# EAGLE schematic LB_SMD (EAGLE 5.11)
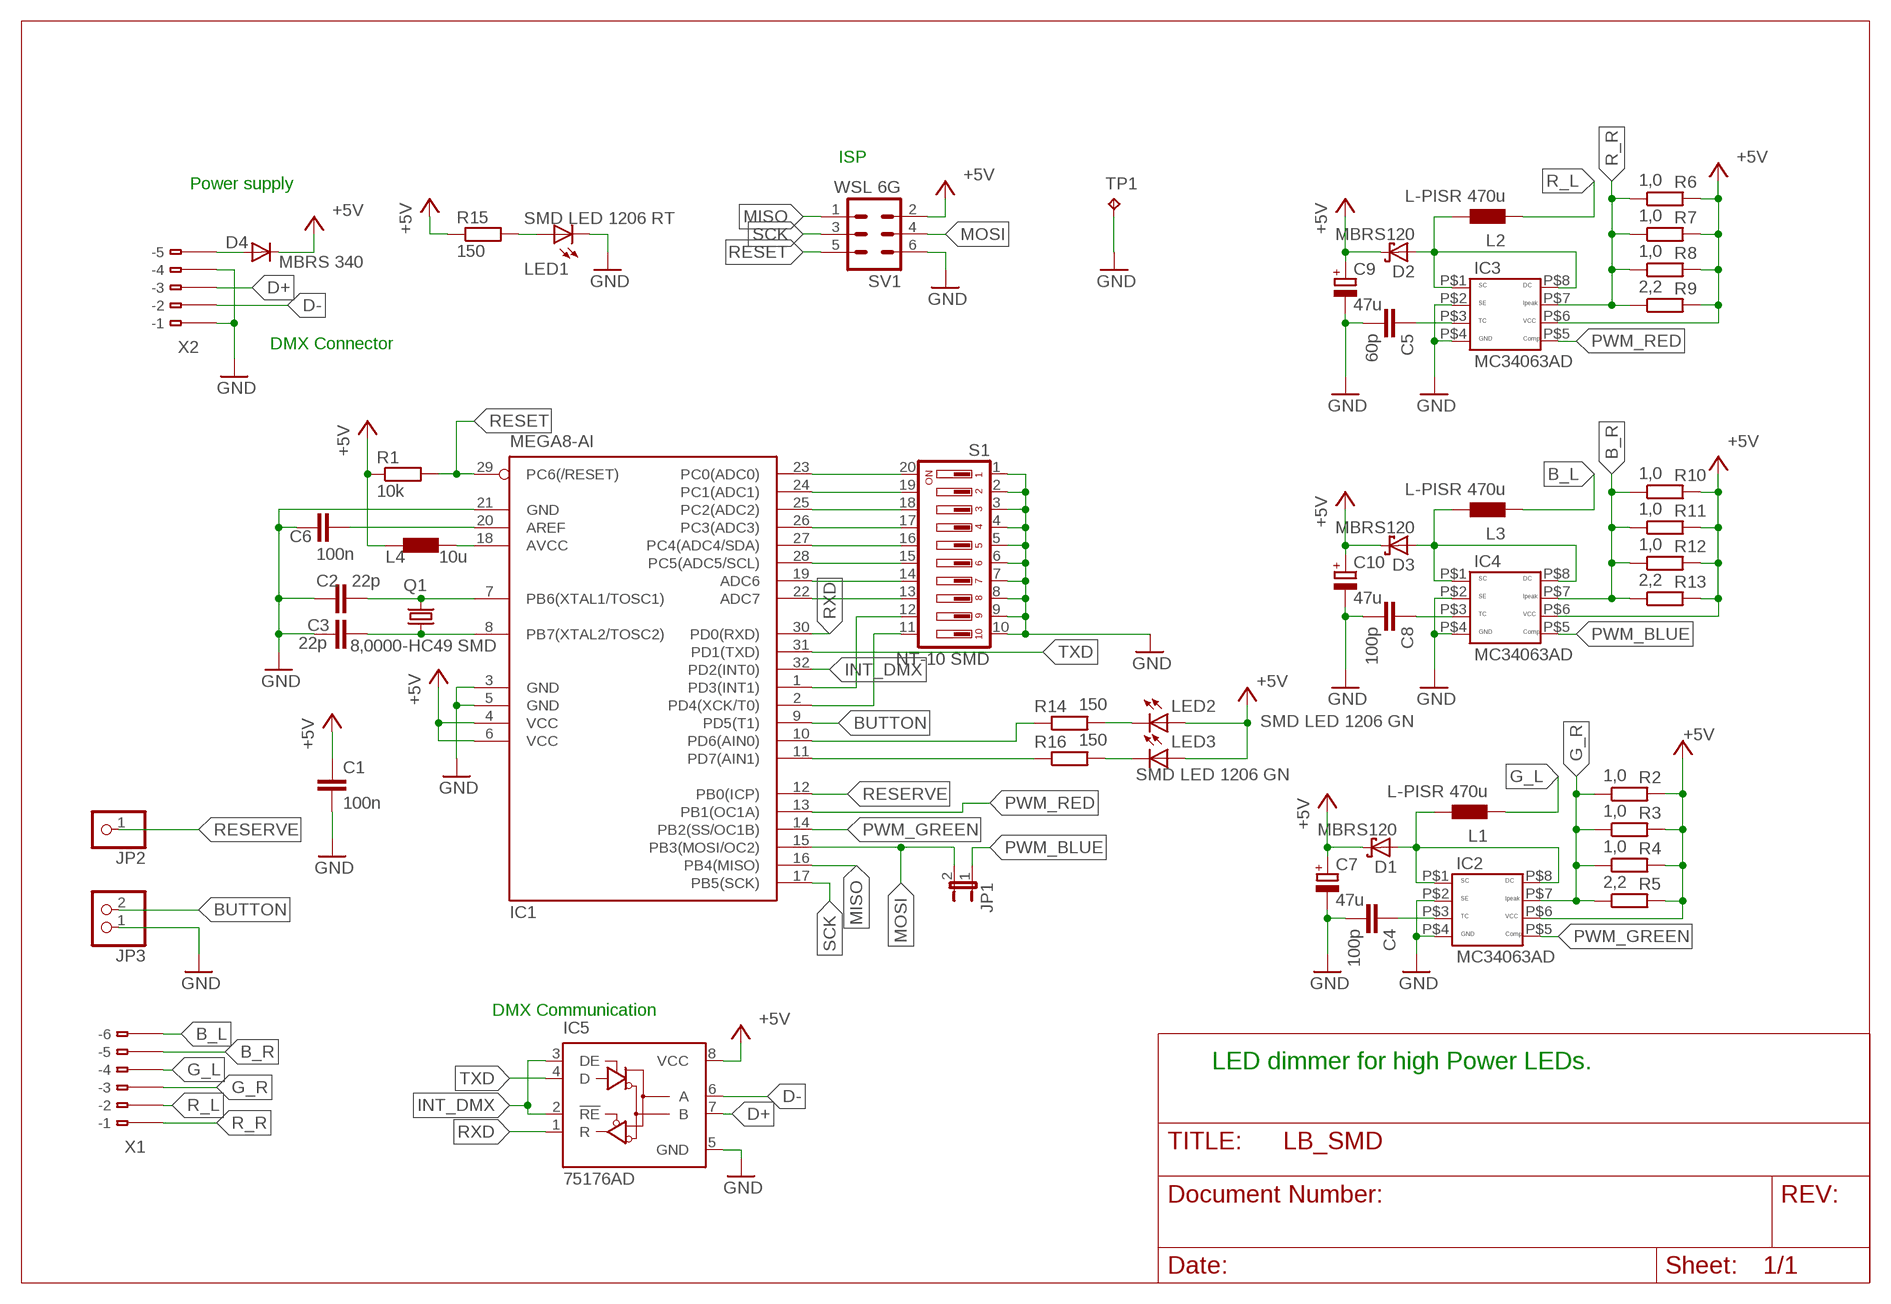
[diagram p0: schematic, sheet 1]

## Parts
C1  100n  C-EUC1206  [C1206]
C2  22p  C-EUC1206  [C1206]
C3  22p  C-EUC1206  [C1206]
C4  100p  C-EUC1206  [C1206]
C5  60p  C-EUC1206  [C1206]
C6  100n  C-EUC1206  [C1206]
C7  47u  CPOL-EUUD-5X5,8  [UD-5X5,8_NICHICON]
C8  100p  C-EUC1206  [C1206]
C9  47u  CPOL-EUUD-5X5,8  [UD-5X5,8_NICHICON]
C10  47u  CPOL-EUUD-5X5,8  [UD-5X5,8_NICHICON]
D1  MBRS120  SCHOTTKY-DIODESMD  [SMB]
D2  MBRS120  SCHOTTKY-DIODESMD  [SMB]
D3  MBRS120  SCHOTTKY-DIODESMD  [SMB]
D4  MBRS 340  DIODE-DO214AA  [DO214AA]
IC1  MEGA8-AI  [TQFP32-08]
IC2  MC34063AD  DIL8  [DIL08]
IC3  MC34063AD  DIL8  [DIL08]
IC4  MC34063AD  DIL8  [DIL08]
IC5  75176AD  [D_R-PDSO-G8]
JP1  JP1E  [JP1]
JP2  PINHD-1X1  [1X01]
JP3  PINHD-1X2  [1X02]
L1  L-PISR 470u  PIS2408  [PIS2408]
L2  L-PISR 470u  PIS2408  [PIS2408]
L3  L-PISR 470u  PIS2408  [PIS2408]
L4  10u  1206F  [1206F]
LED1  SMD LED 1206 RT  LEDCHIPLED_1206  [CHIPLED_1206]
LED2  SMD LED 1206 GN  LEDCHIPLED_1206  [CHIPLED_1206]
LED3  SMD LED 1206 GN  LEDCHIPLED_1206  [CHIPLED_1206]
Q1  8,0000-HC49 SMD  CRYSTALSM49  [SM49]
R1  10k  R-EU_M1206  [M1206]
R2  1,0  R-EU_M1206  [M1206]
R3  1,0  R-EU_M1206  [M1206]
R4  1,0  R-EU_M1206  [M1206]
R5  2,2  R-EU_M1206  [M1206]
R6  1,0  R-EU_M1206  [M1206]
R7  1,0  R-EU_M1206  [M1206]
R8  1,0  R-EU_M1206  [M1206]
R9  2,2  R-EU_M1206  [M1206]
R10  1,0  R-EU_M1206  [M1206]
R11  1,0  R-EU_M1206  [M1206]
R12  1,0  R-EU_M1206  [M1206]
R13  2,2  R-EU_M1206  [M1206]
R14  150  R-EU_M1206  [M1206]
R15  150  R-EU_M1206  [M1206]
R16  150  R-EU_M1206  [M1206]
S1  NT-10 SMD  219-10  [CTS-219-10]
SV1  WSL 6G  MA03-2  [MA03-2]
TP1  TPTP18R  [TP18R]
X1  233-506  [233-506]
X2  233-505  [233-505]

## Nets
+5V: C1.1 C7.+ C9.+ C10.+ D1.C D2.C D3.C D4.C IC1.4(VCC) IC1.6(VCC) IC2.P$6 IC3.P$6 IC4.P$6 IC5.8(VCC) L4.P$1 LED2.A LED3.A R1.1 R2.2 R3.2 R4.2 R5.2 R6.2 R7.2 R8.2 R9.2 R10.2 R11.2 R12.2 R13.2 R15.1 SV1.2
B_L: L3.P$1 X1.B6(B-6)
B_R: IC4.P$7 R10.1 R11.1 R12.1 R13.1 X1.B5(B-5)
BUTTON: IC1.9(PD5(T1)) JP3.2
D+: IC5.7(B) X2.B3(B-3)
D-: IC5.6(A) X2.B2(B-2)
G_L: L1.P$1 X1.B4(B-4)
G_R: IC2.P$7 R2.1 R3.1 R4.1 R5.1 X1.B3(B-3)
GND: C1.2 C2.1 C3.1 C4.2 C5.2 C6.1 C7.- C8.2 C9.- C10.- IC1.3(GND) IC1.5(GND) IC1.21(GND) IC2.P$2 IC2.P$4 IC3.P$2 IC3.P$4 IC4.P$2 IC4.P$4 IC5.5(GND) JP3.1 LED1.C S1.1 S1.2 S1.3 S1.4 S1.5 S1.6 S1.7 S1.8 S1.9 S1.10 SV1.6 TP1.TP X2.B1(B-1) X2.B4(B-4)
INT_DMX: IC1.32(PD2(INT0)) IC5.2(!RE) IC5.3(DE)
MISO: IC1.16(PB4(MISO)) SV1.1
MOSI: IC1.15(PB3(MOSI/OC2)) JP1.2 SV1.4
N$2: C3.2 IC1.8(PB7(XTAL2/TOSC2)) Q1.1
N$3: C2.2 IC1.7(PB6(XTAL1/TOSC1)) Q1.2
N$7: IC1.23(PC0(ADC0)) S1.20
N$9: C6.2 IC1.20(AREF)
N$14: IC1.18(AVCC) L4.P$2
N$15: IC1.24(PC1(ADC1)) S1.19
N$16: IC1.25(PC2(ADC2)) S1.18
N$17: IC1.26(PC3(ADC3)) S1.17
N$18: IC1.27(PC4(ADC4/SDA)) S1.16
N$19: IC1.28(PC5(ADC5/SCL)) S1.15
N$20: IC1.19(ADC6) S1.14
N$21: D3.A IC4.P$1 IC4.P$8 L3.P$2
N$22: IC1.22(ADC7) S1.13
N$27: IC1.10(PD6(AIN0)) R14.1
N$28: LED2.C R14.2
N$29: D4.A X2.B5(B-5)
N$30: LED1.A R15.2
N$31: IC1.11(PD7(AIN1)) R16.1
N$33: LED3.C R16.2
N$45: C5.1 IC3.P$3
N$47: D2.A IC3.P$1 IC3.P$8 L2.P$2
N$52: C4.1 IC2.P$3
N$53: D1.A IC2.P$1 IC2.P$8 L1.P$2
N$59: C8.1 IC4.P$3
PWM_BLUE: IC4.P$5 JP1.1
PWM_GREEN: IC1.14(PB2(SS/OC1B)) IC2.P$5
PWM_RED: IC1.13(PB1(OC1A)) IC3.P$5
R_L: L2.P$1 X1.B2(B-2)
R_R: IC3.P$7 R6.1 R7.1 R8.1 R9.1 X1.B1(B-1)
RESERVE: IC1.12(PB0(ICP)) JP2.1
RESET: IC1.29(PC6(/RESET)) R1.2 SV1.5
RXD: IC1.30(PD0(RXD)) IC5.1(R)
SCK: IC1.17(PB5(SCK)) SV1.3
T9: IC1.1(PD3(INT1)) S1.12
T10: IC1.2(PD4(XCK/T0)) S1.11
TXD: IC1.31(PD1(TXD)) IC5.4(D)
Unconnected: X1.A1(-1) X1.A2(-2) X1.A3(-3) X1.A4(-4) X1.A5(-5) X1.A6(-6) X2.A1(-1) X2.A2(-2) X2.A3(-3) X2.A4(-4) X2.A5(-5)

## Notes on the sheet
- ISP
- Power supply
- DMX Connector
- DMX Communication
- LED dimmer for high Power LEDs.

## Library data of the parts
C1-C6 C8 = rcl:C-EU: CAPACITOR, European symbol
C7 C9 C10 = rcl:CPOL-EU: POLARIZED CAPACITOR, European symbol
D1-D3 = diode:SCHOTTKY-DIODE: Schottky Diode
D4 = diode:DIODE-: DIODE
IC1 = atmel:MEGA8: MICROCONTROLLER 8 Kbytes FLASH, 1 kbytes SRAM, 512 bytes EEPROM, USART, 6-channel 10 bit ADC, 2-channel 8 bit ADC Pin compatible with Atmega48, ATMega88, ATMega168 Source: avr.lbr; MPN: ATMEGA8-16AU; OC_FARNELL: 9171371; OC_NEWARK: 73M8863
IC2-IC4 = MC34063AD:DIL8: Dual In Line / Socket
IC5 = 751xx:75176A: DIFFERENTIAL BUS TRANSCEIVER Source: http://focus.ti.com/lit/ds/symlink/sn75176a.pdf
JP1 = jumper:JP1E: JUMPER
JP2 = pinhead:PINHD-1X1: PIN HEADER
JP3 = pinhead:PINHD-1X2: PIN HEADER
L1-L3 = inductor-fastron_pisr:PIS2408: Fastron SMD Power Inductors Source: http://www.fastrongroup.com/series/47/findProducts
L4 = inductor-fastron:1206F
LED1-LED3 = led:LED: LED OSRAM: - CHIPLED LG R971, LG N971, LY N971, LG Q971, LY Q971, LO R971, LY R971 LH N974, LH R974 LS Q976, LO Q976, LY Q976 LO Q996 - Hyper CHIPLED LW Q18S LB Q993, LB Q99A, LB R99A - SideLED LS A670, LO A670, LY A670, LG A670, LP A670 LB A673, LV A673, LT A673, LW A673 LH A674 LY A675 LS A676, LA A676, LO A676, LY A676, LW A676 LS A679, LY A679, LG A679 - Hyper Micro SIDELED® LS Y876, LA Y876, LO Y876, LY Y876 LT Y87S - SmartLED LW L88C, LW L88S LB L89C, LB L89S, LG L890 LS L89K, LO L89K, LY L89K LS L896, LA L896, LO L896, LY L896 - TOPLED LS T670, LO T670, LY T670, LG T670, LP T670 LSG T670, LSP T670, LSY T670, LOP T670, LYG T670 LG T671, LOG T671, LSG T671 LB T673, LV T673, LT T673, LW T673 LH T674 LS T676, LA T676, LO T676, LY T676, LB T676, LH T676, LSB T676, LW T676 LB T67C, LV T67C, LT T67C, LS T67K, LO T67K, LY T67K, LW E67C LS E67B, LA E67B, LO E67B, LY E67B, LB E67C, LV E67C, LT E67C LW T67C LS T679, LY T679, LG T679 LS T770, LO T770, LY T770, LG T770, LP T770 LB T773, LV T773, LT T773, LW T773 LH T774 LS E675, LA E675, LY E675, LS T675 LS T776, LA T776, LO T776, LY T776, LB T776 LHGB T686 LT T68C, LB T68C - Hyper Mini TOPLED® LB M676 - Mini TOPLED Santana® LG M470 LS M47K, LO M47K, LY M47K Source: http://www.osram.convergy.de LUXEON: - LUMILED® LXK2-PW12-R00, LXK2-PW12-S00, LXK2-PW14-U00, LXK2-PW14-V00 LXK2-PM12-R00, LXK2-PM12-S00, LXK2-PM14-U00 LXK2-PE12-Q00, LXK2-PE12-R00, LXK2-PE12-S00, LXK2-PE14-T00, LXK2-PE14-U00 LXK2-PB12-K00, LXK2-PB12-L00, LXK2-PB12-M00, LXK2-PB14-N00, LXK2-PB14-P00, LXK2-PB14-Q00 LXK2-PR12-L00, LXK2-PR12-M00, LXK2-PR14-Q00, LXK2-PR14-R00 LXK2-PD12-Q00, LXK2-PD12-R00, LXK2-PD12-S00 LXK2-PH12-R00, LXK2-PH12-S00 LXK2-PL12-P00, LXK2-PL12-Q00, LXK2-PL12-R00 Source: www.luxeon.com KINGBRIGHT: KA-3528ASYC Source: www.kingbright.com
Q1 = crystal:CRYSTAL: CRYSTAL; OC_FARNELL: unknown; OC_NEWARK: unknown
R1-R16 = rcl:R-EU_: RESISTOR, European symbol
S1 = switch-dil:219-10*: Surface Mount DIP Switch Series 219 SMT CTS Electronic Components Sourc: www.ctscorp.com; MF: SLI (CML/IDI); MPN: 219-10PK; OC_FARNELL: unknown; OC_NEWARK: 19M0224
SV1 = con-lstb:MA03-2: PIN HEADER; OC_FARNELL: unknown; OC_NEWARK: unknown
TP1 = testpad:TP: Test pad
X1 = con-wago:233-506: WAGO Cage Clamp; MF: Wago Corporation; MPN: 0233-0506; OC_FARNELL: 1777100; OC_NEWARK: 79K2052
X2 = con-wago:233-505: WAGO Cage Clamp; MF: Wago Corporation; MPN: 0233-0505; OC_FARNELL: unknown; OC_NEWARK: 79K2051